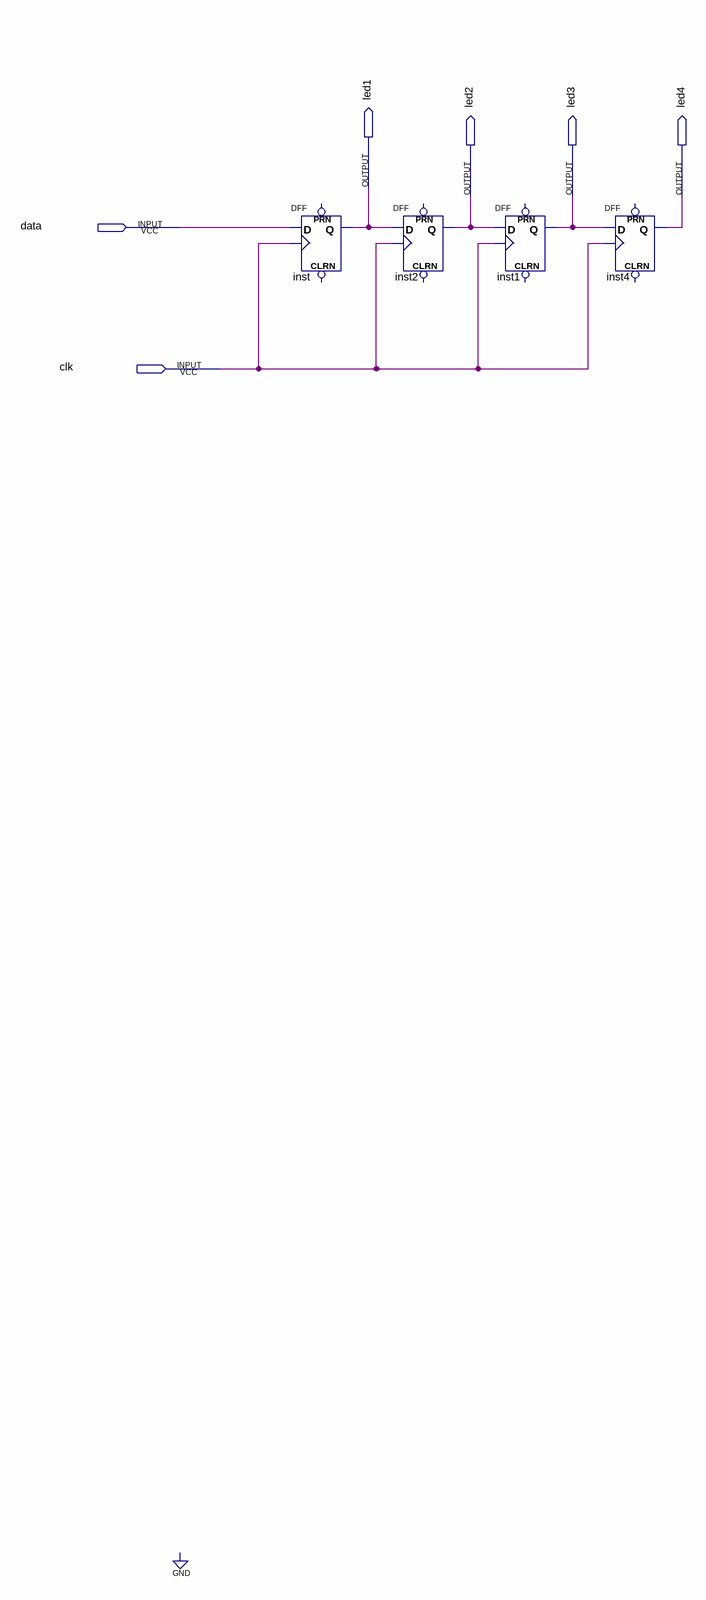
[diagram p0: schematic sheet]
// Quartus schematic sipo.bdf as structural Verilog: 4 symbols, 6 pins
module sipo (
  input  data,
  input  clk,
  output led1,
  output led2,
  output led3,
  output led4
);

  DFF inst (.CLK(clk), .D(data), .Q(led1));  // open: CLRN, PRN
  DFF inst2 (.CLK(clk), .D(led1), .Q(led2));  // open: CLRN, PRN
  DFF inst1 (.CLK(clk), .D(led2), .Q(led3));  // open: CLRN, PRN
  DFF inst4 (.CLK(clk), .D(led3), .Q(led4));  // open: CLRN, PRN
endmodule
